# EAGLE design untitled (EAGLE 9.6.2)
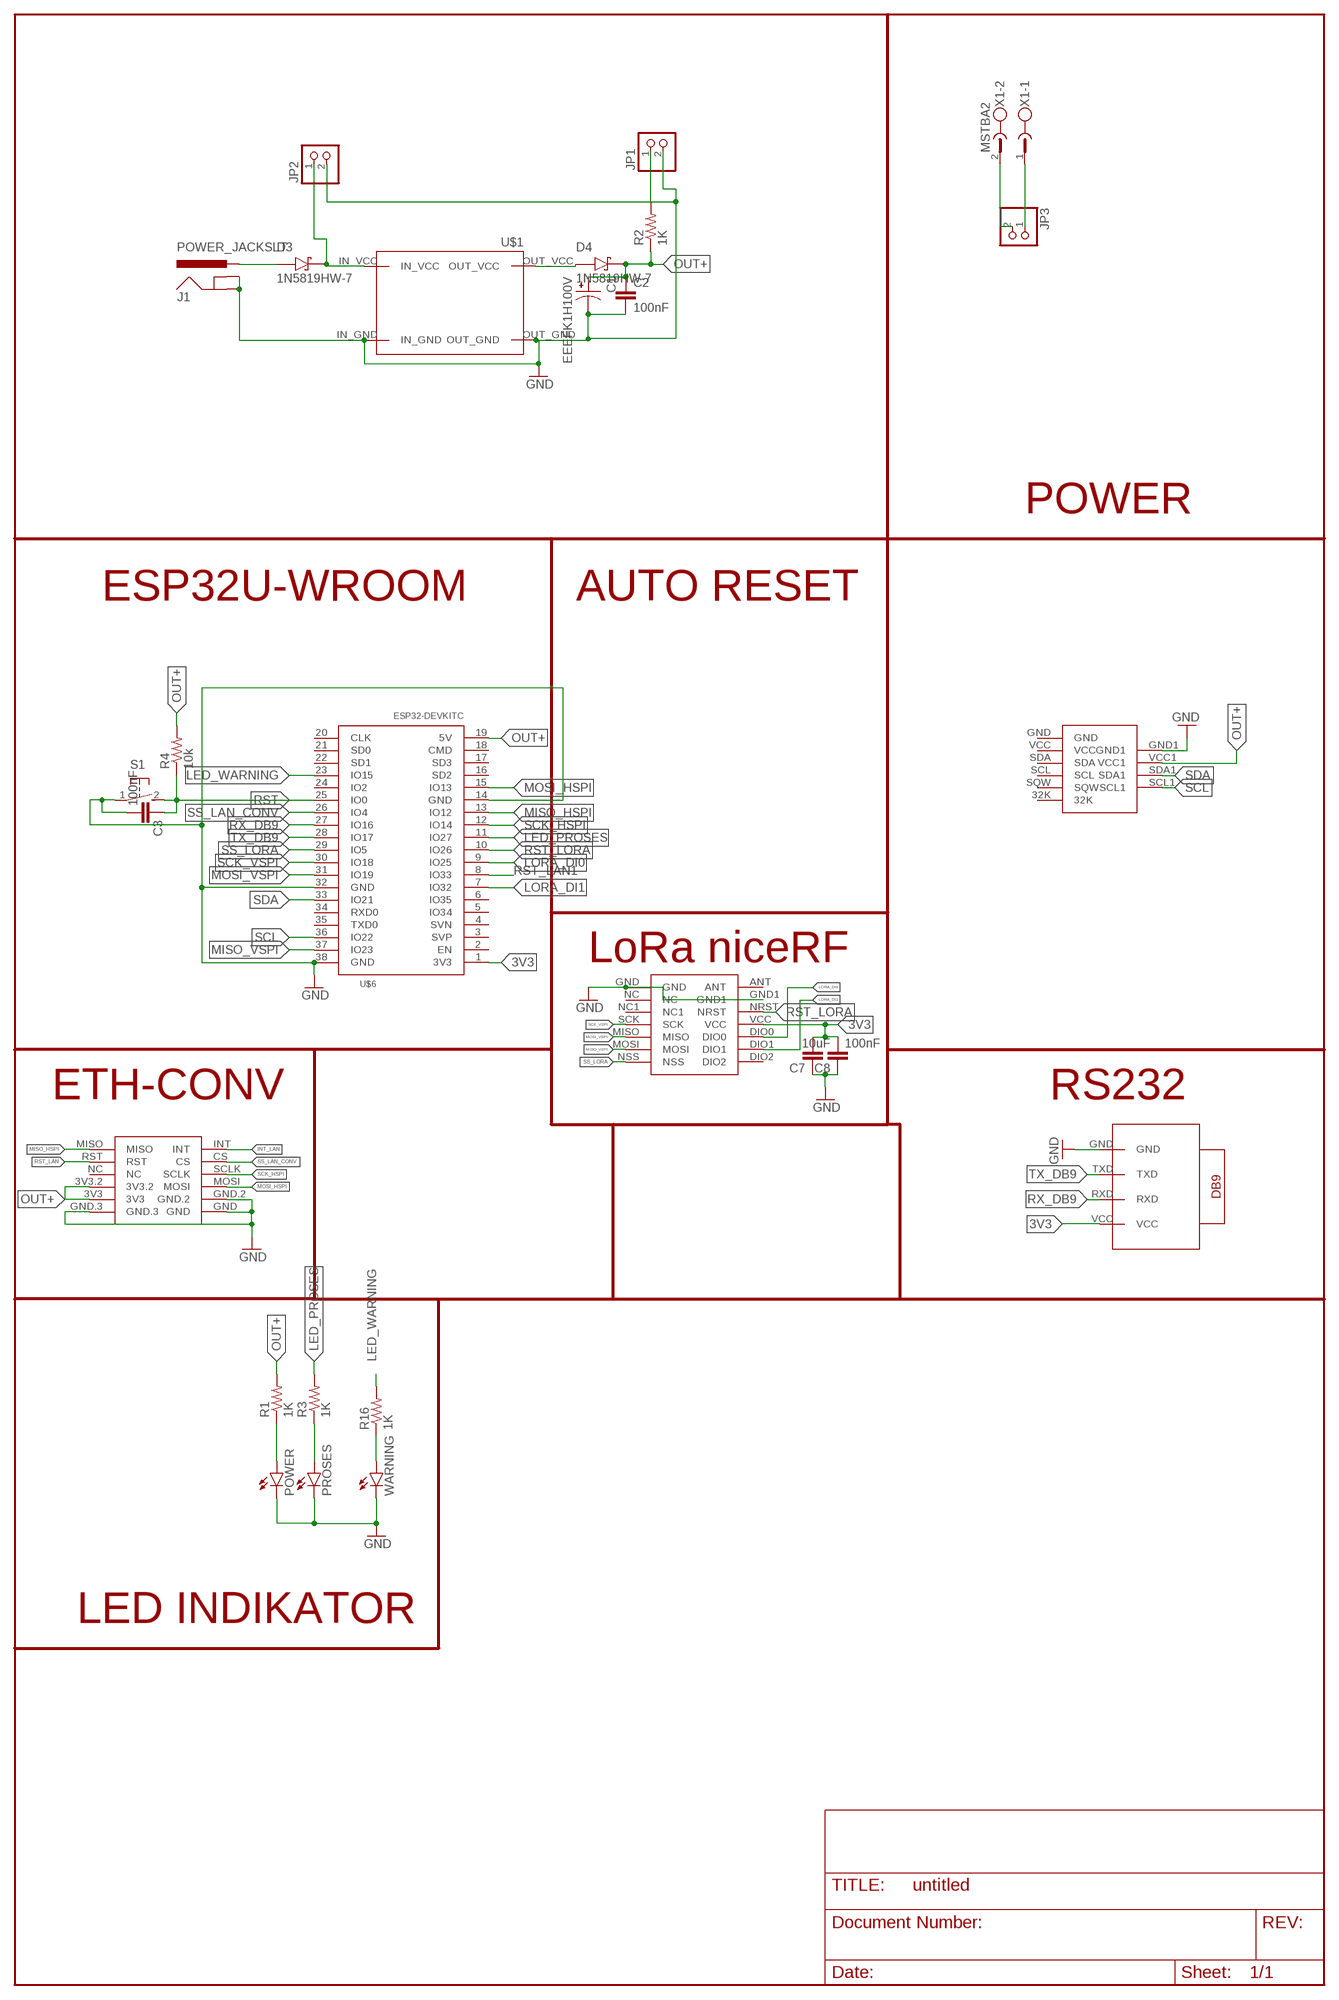
[diagram p0: schematic, sheet 1]

## Parts
C1  EEEFK1H100V  [CAP_EEEFK1H100V]
C2  100nF  C-EUC0805K  [C0805K]
C3  100nF  C-EUC0805K  [C0805K]
C7  10uF  C-EUC0805K  [C0805K]
C8  100nF  C-EUC0805K  [C0805K]
D3  1N5819HW-7  [SOD3715X145N]
D4  1N5819HW-7  [SOD3715X145N]
J1  POWER_JACKSLT  [POWER_JACK_SLOT]
JP1  PINHD-1X2  [1X02]
JP2  PINHD-1X2  [1X02]
JP3  PINHD-1X2  [1X02]
LORA-NICERF-V1  LORA-NICERF-V2  [LORA-NICERF-V2]
POWER  TLLR4400  [LED3MM]
PROSES  TLLR4400  [LED3MM]
R1  1K  R-US_M0805  [M0805]
R2  1K  R-US_M0805  [M0805]
R3  1K  R-US_M0805  [M0805]
R4  10k  R-US_M0805  [M0805]
R16  1K  R-US_M0805  [M0805]
RTC1  RTC3231  [RTC3231]
S1  31-XX  [B3F-31XX]
U$1  STEPDOWN_SY8205  [STEPDOWN_SY8205]
U$3  MINI_W5500  [MINI_W5500]
U$5  RS232-BREAKOUTBREAKOUT  [RS232-BREAKOUT]
U$6  ESP32DEVKITC  [ESP32-DEVKITC]
WARNING  TLLR4400  [LED3MM]
X1  MSTBA2  [MSTBA2]

## Nets
3V3: C7.2 C8.2 LORA-NICERF-V1.VCC U$5.VCC U$6.1(3V3)
GND: C1.2 C2.2 C3.2 C7.1 C8.1 J1.GND@1(GNDBREAK) J1.GND@2(GND) JP1.2 JP2.2 LORA-NICERF-V1.GND LORA-NICERF-V1.GND1 POWER.K(C) PROSES.K(C) RTC1.GND1 S1.1(P) U$1.IN_GND U$1.OUT_GND U$3.GND U$3.GND.2 U$3.GND.3 U$5.GND U$6.14(GND) U$6.32(GND) U$6.38(GND) WARNING.K(C)
INT_LAN: U$3.INT
LED_PROSES: R3.2 U$6.11(IO27)
LED_WARNING: R16.2 U$6.23(IO15)
LORA_DI0: LORA-NICERF-V1.DIO0 U$6.9(IO25)
LORA_DI1: LORA-NICERF-V1.DIO1 U$6.7(IO32)
MISO_HSPI: U$3.MISO U$6.13(IO12)
MISO_VSPI: LORA-NICERF-V1.MOSI U$6.37(IO23)
MOSI_HSPI: U$3.MOSI U$6.15(IO13)
MOSI_VSPI: LORA-NICERF-V1.MISO U$6.31(IO19)
N$1: POWER.A R1.1
N$2: D3.A J1.PWR
N$3: PROSES.A R3.1
N$4: D3.C(K) JP2.1 U$1.IN_VCC
N$5: JP3.2 X1.2
N$6: D4.A U$1.OUT_VCC
N$7: JP1.1 R2.2
N$8: JP3.1 X1.1
N$16: R16.1 WARNING.A
OUT+: C1.1 C2.1 D4.C(K) R1.2 R2.1 R4.2 RTC1.VCC1 U$3.3V3 U$3.3V3.2 U$6.19(5V)
RST: C3.1 R4.1 S1.2(S) U$6.25(IO0)
RST_LAN: U$3.RST
RST_LAN1: U$6.8(IO33)
RST_LORA: LORA-NICERF-V1.NRST U$6.10(IO26)
RX_DB9: U$5.RXD U$6.27(IO16)
SCK_HSPI: U$3.SCLK U$6.12(IO14)
SCK_VSPI: LORA-NICERF-V1.SCK U$6.30(IO18)
SCL: RTC1.SCL1 U$6.36(IO22)
SDA: RTC1.SDA1 U$6.33(IO21)
SS_LAN_CONV: U$3.CS U$6.26(IO4)
SS_LORA: LORA-NICERF-V1.NSS U$6.29(IO5)
TX_DB9: U$5.TXD U$6.28(IO17)
Unconnected: LORA-NICERF-V1.ANT LORA-NICERF-V1.DIO2 LORA-NICERF-V1.NC LORA-NICERF-V1.NC1 RTC1.32K RTC1.GND RTC1.SCL RTC1.SDA RTC1.SQW RTC1.VCC U$3.NC U$6.2(EN) U$6.3(SVP) U$6.4(SVN) U$6.5(IO34) U$6.6(IO35) U$6.16(SD2) U$6.17(SD3) U$6.18(CMD) U$6.20(CLK) U$6.21(SD0) U$6.22(SD1) U$6.24(IO2) U$6.34(RXD0) U$6.35(TXD0)

## Notes on the sheet
- POWER
- ESP32U-WROOM | AUTO RESET
- LoRa niceRF
- ETH-CONV | RS232
- LED INDIKATOR

## Library data of the parts
C1 = EEEFK1H100V:EEEFK1H100V: Check availability <https://pricing.snapeda.com/parts/EEEFK1H100V/Panasonic/view-part?ref=eda>; AVAILABILITY: In Stock; DESCRIPTION: CAP ALUM 10UF 20% 50V SMD; MF: Panasonic; MP: EEEFK1H100V; PACKAGE: RADIAL-2 Panasonic; PRICE: None; PURCHASE-URL: https://pricing.snapeda.com/search/part/EEEFK1H100V/?ref=eda
C2 C3 C7 C8 = rcl:C-EU: CAPACITOR, European symbol; SPICEPREFIX: C
D3 D4 = 1N5819HW-7:1N5819HW-7: 1N5819HW Series 40 V 1 A Surface Mount Schottky Barrier Rectifier - SOD-123 Check availability <https://pricing.snapeda.com/parts/1N5819HW-7/Diodes%20Inc./view-part?ref=eda>; AVAILABILITY: In Stock; DESCRIPTION: Diode Schottky 40 V 1A Surface Mount SOD-123; MF: Diodes Inc.; MP: 1N5819HW-7; PACKAGE: SOD-123 Fairchild Semiconductor; PRICE: None; PURCHASE-URL: https://pricing.snapeda.com/search/part/1N5819HW-7/?ref=eda
J1 = SparkFun-Connectors:POWER_JACK: Power Jack Connector This is the standard 5.5mm barrel jack for power. The PTH is the most common, proven, reliable, footprint. The Slot footprint only works if the mill layer is transmitted to the PCB fab house so be warned. Here are the connectors we sell at SparkFun: DC Barrel Power Jack/Connector <https://www.sparkfun.com/products/119> (PRT-00119) DC Barrel Power Jack/Connector (SMD) <https://www.sparkfun.com/products/12748> (PRT-12748) DC Barrel Jack Adapter - Breadboard Compatible <https://www.sparkfun.com/products/10811> (PRT-10811) It is used on this SparkFun product (and many, many others): SparkFun RedBoard - Programmed with Arduino <https://www.sparkfun.com/products/12757> (DEV-12757) Also, if you need a mating power supply or connector, please check these out: Wall Adapter Power Supply - 9VDC 650mA <https://www.sparkfun.com/products/298> (TOL-00298) DC Barrel Jack Adapter - Male <https://www.sparkfun.com/products/10287> (PRT-10287); PROD_ID: PRT-00119
JP1-JP3 = pinhead:PINHD-1X2: PIN HEADER
LORA-NICERF-V1 = LORA-NICERF-V2:LORA-NICERF-V2
POWER PROSES WARNING = led:TLLR4400: Low Current (2mA) LED 3 mm Tinted Diffused Package color RED Source: Data sheet <http://www.farnell.com/datasheets/391100.pdf>; MF: VISHAY SEMICONDUCTOR; OC_FARNELL: 1612437
R1-R4 R16 = adafruit:R-US_: RESISTOR, American symbol
RTC1 = rtc3231:RTC3231
S1 = switch-omron:31-XX: OMRON SWITCH; MPN: B3F-3100; OC_FARNELL: 959704; OC_NEWARK: 36M3582
U$1 = STEPDOWN_SY8205:STEPDOWN_SY8205
U$3 = ethernet-mikroavr:MINI_W5500: MINI ETHERNET W5500, CREATE BY MIKROAVR.COM
U$5 = RS232-BREAKOUT:RS232-BREAKOUT
U$6 = ESP32-DEVKITC:ESP32DEVKITC
X1 = con-phoenix-508:MSTBA2: PHOENIX; MF: FARNELL; MPN: 1757242; OC_FARNELL: 3705171; OC_NEWARK: 71C4161

## Net classes
0 default: clearance 0.1 mm

## Board
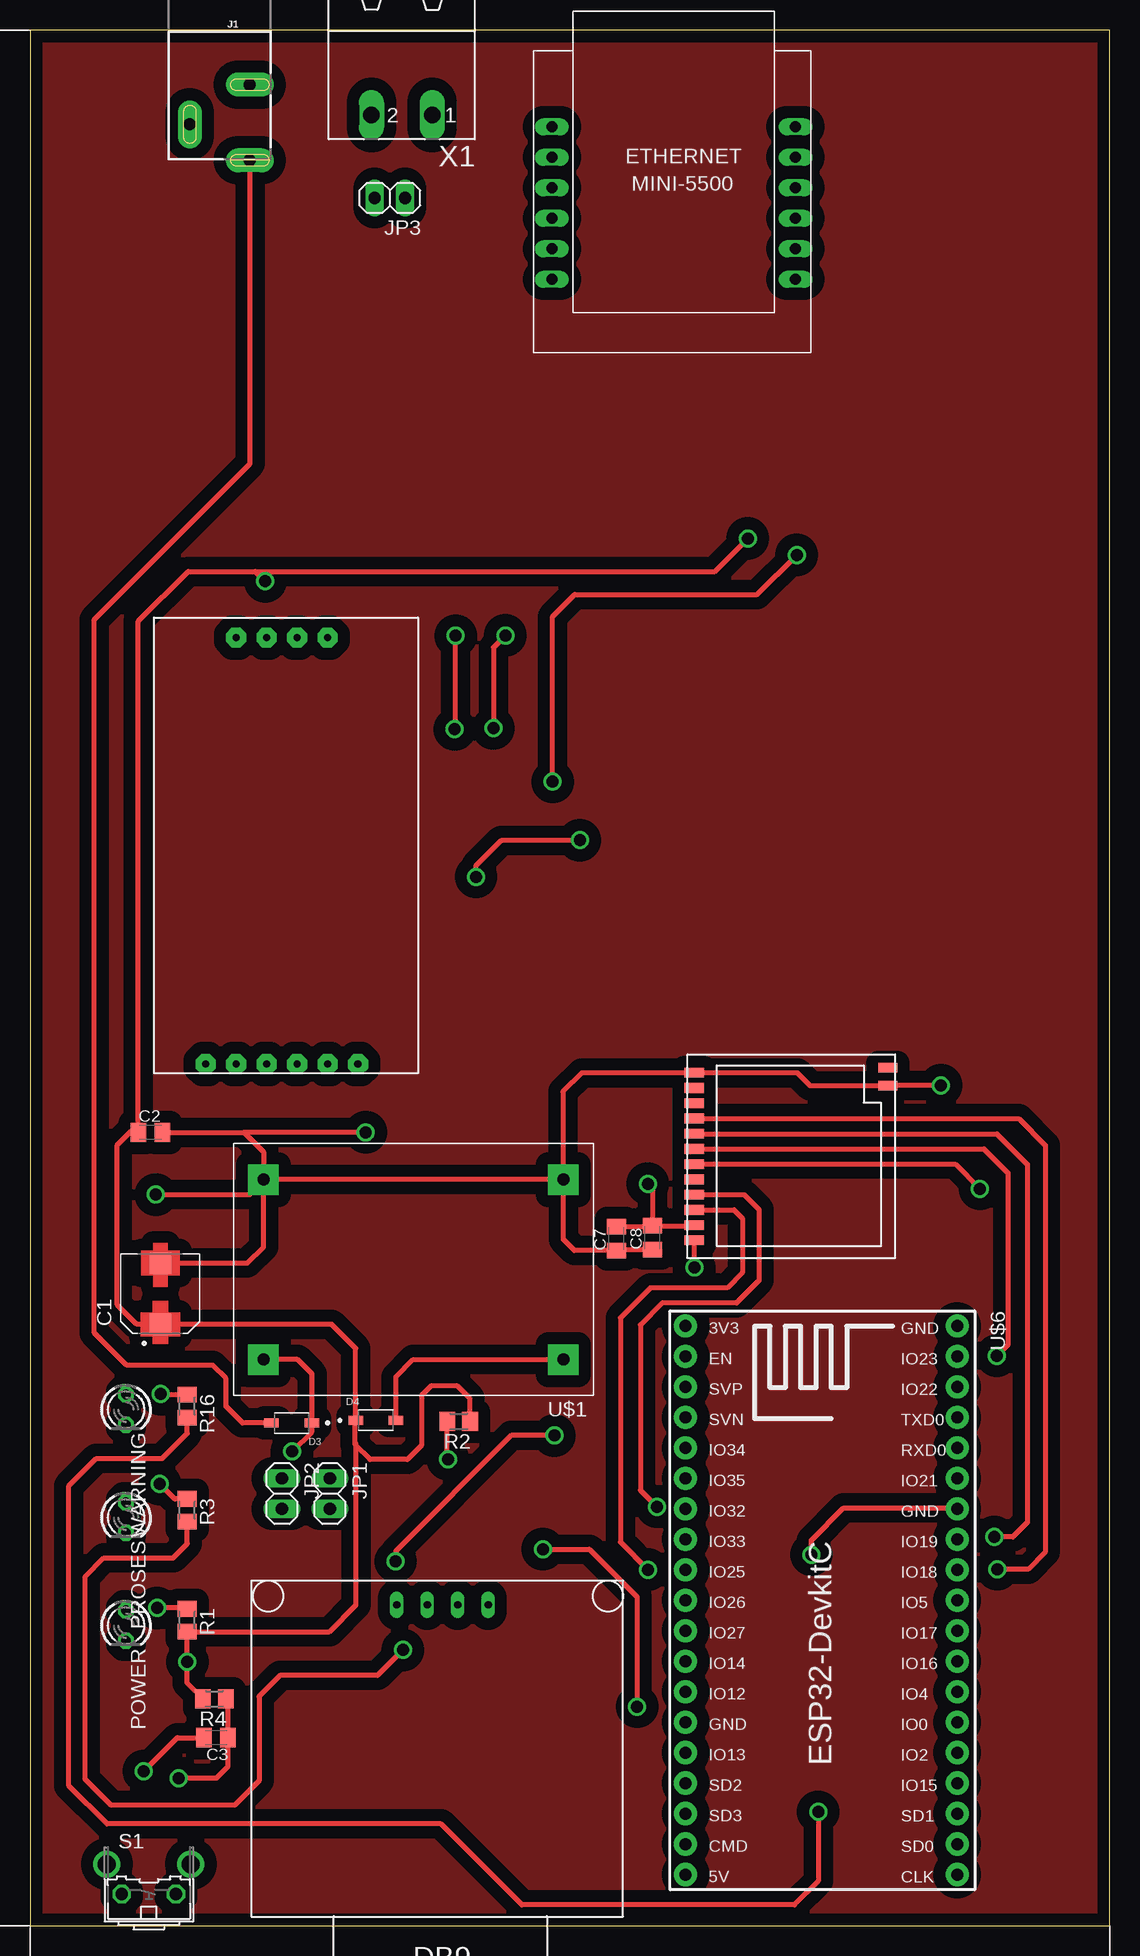
[diagram p1: board, top side]
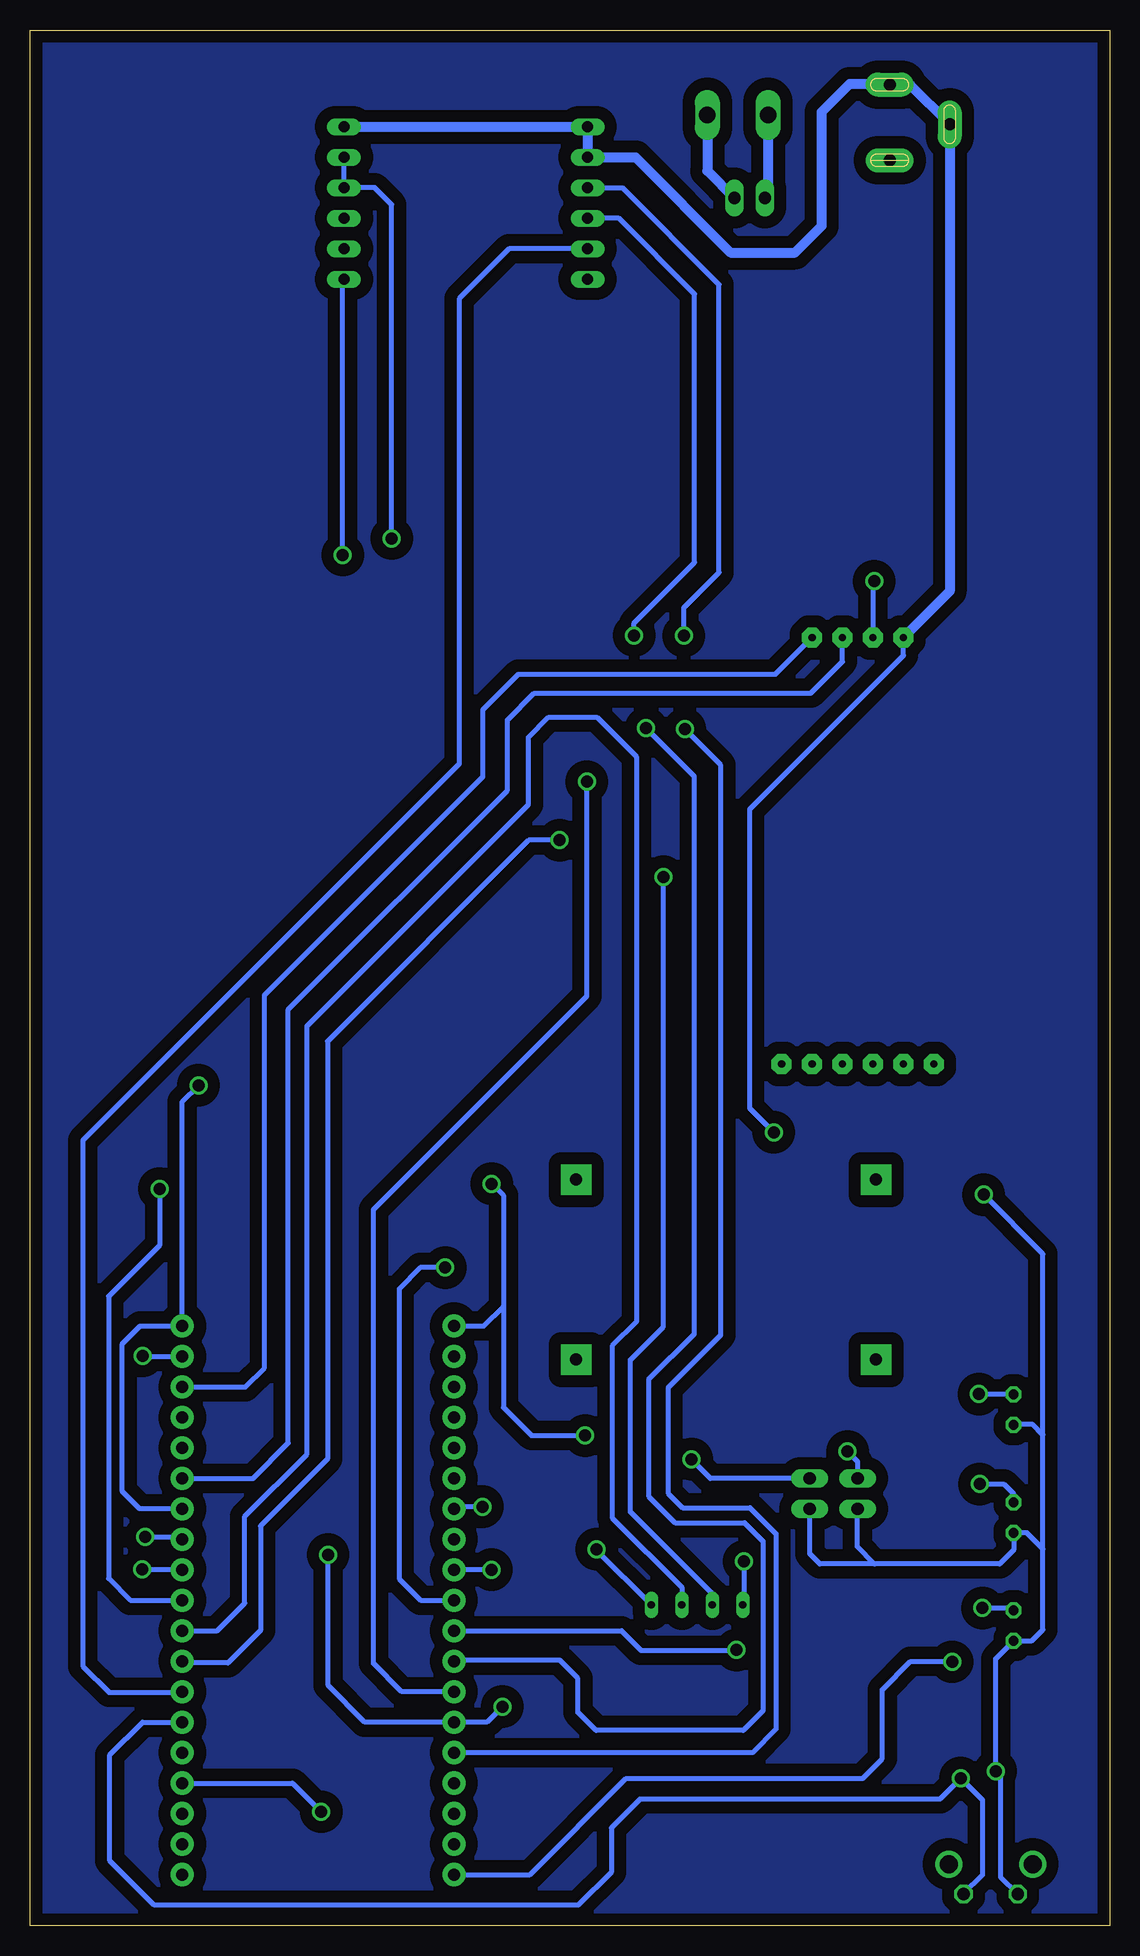
[diagram p2: board, bottom side, seen from below]

Size 90 x 158 mm. Coordinates in mm from the lower left corner, seen from the top.
Outline: 0,0 90,0 90,158 0,158 0,0
Copper layers (1*16): Top 0.035mm / dielectric 1.5mm / Bottom 0.035mm
Design rules "default": minimum track width 6mil, minimum drill 0.35mm, track to track 6mil, track to pad 6mil, pad to pad 6mil, via to via 6mil, smd to smd 6mil, copper to edge 40mil, drill to drill 6mil, minimum pad ring 10mil, minimum via ring 8mil, stop-mask expansion 4mil, vias tented up to drill 0mil, thermal gap 10mil

### Footprints (pad centres in the part's own frame; a part is rotated, then mirrored left to right if it is on the bottom)
CAP_EEEFK1H100V = smd 1.8 x 1.8: 1 -2.55,0; 2 2.55,0
C0805K = smd 1.3 x 1.6: 1 -1,0; 2 1,0
SOD3715X145N = smd 1.21 x 0.73: A 1.68,0; C -1.68,0
POWER_JACK_SLOT = drill 1 pad 2 long: GND@1 2.58,7.5; GND@2 7.58,10.8; PWR 2.58,13.8
1X02 = drill 1.016 long: 1 -1.27,0; 2 1.27,0
LORA-NICERF-V2 = smd 1.6 x 0.8: ANT 8.37,6.81; DIO0 -7.77,-5.03; DIO1 -7.77,-3.76; DIO2 -7.77,-2.49; GND -7.77,6.4; GND1 8.37,5.31; MISO -7.77,1.32; MOSI -7.77,0.05; NC -7.77,5.13; NC1 -7.77,3.86; NRST -7.77,-7.57; NSS -7.77,-1.22; SCK -7.77,2.59; VCC -7.77,-6.3
LED3MM = drill 0.813 octagon: A -1.27,0; K 1.27,0
M0805 = smd 1.3 x 1.6: 1 -0.95,0; 2 0.95,0
RTC3231 = drill 0.6 pad 1.676 octagon: 32K -15.24,0; GND -15.24,12.7; GND1 20.32,10.16; SCL -15.24,5.08; SCL1 20.32,2.54; SDA -15.24,7.62; SDA1 20.32,5.08; SQW -15.24,2.54; VCC -15.24,10.16; VCC1 20.32,7.62
B3F-31XX = drill 1.016 octagon: 1 -2.261,-1.245; 2 2.261,-1.245 | drill 1.499 pad 2.159: 3 -3.505,1.245; 4 3.505,1.245
STEPDOWN_SY8205 = drill 1 pad 2.54 square: IN_GND 18,-2.5; IN_VCC 3,-2.5; OUT_GND 18,-27.5; OUT_VCC 3,-27.5
MINI_W5500 = drill 0.914 long: 3V3 21.844,-8.89; 3V3.2 21.844,-11.43; CS 1.524,-16.51; GND 1.524,-6.35; GND.2 1.524,-8.89; GND.3 21.844,-6.35; INT 1.524,-19.05; MISO 21.844,-19.05; MOSI 1.524,-11.43; NC 21.844,-13.97; RST 21.844,-16.51; SCLK 1.524,-13.97
RS232-BREAKOUT = drill 0.6 long: GND 11.25,2; RXD 16.33,2; TXD 13.79,2; VCC 18.87,2
ESP32-DEVKITC = drill 1 pad 1.93: 1 -22.87,-11.42; 2 -20.33,-11.42; 3 -17.79,-11.42; 4 -15.25,-11.42; 5 -12.71,-11.42; 6 -10.17,-11.42; 7 -7.63,-11.42; 8 -5.09,-11.42; 9 -2.55,-11.42; 10 -0.01,-11.42; 11 2.53,-11.42; 12 5.07,-11.42; 13 7.61,-11.42; 14 10.15,-11.42; 15 12.69,-11.42; 16 15.23,-11.42; 17 17.77,-11.42; 18 20.31,-11.42; 19 22.85,-11.42; 20 22.85,11.23; 21 20.31,11.23; 22 17.77,11.23; 23 15.23,11.23; 24 12.69,11.23; 25 10.15,11.23; 26 7.61,11.23; 27 5.07,11.23; 28 2.53,11.23; 29 -0.01,11.23; 30 -2.55,11.23; 31 -5.09,11.23; 32 -7.63,11.23; 33 -10.17,11.23; 34 -12.71,11.23; 35 -15.25,11.23; 36 -17.79,11.23; 37 -20.33,11.23; 38 -22.87,11.23
MSTBA2 = drill 1.397 long: 1 -2.54,5.08; 2 2.54,5.08

### Placement (x,y rotation side)
C1  10.86,52.66 90 top
C2  10.04,66.11 0 top
C3  15.51,15.66 180 top
C7  48.89,57.26 90 top
C8  51.89,57.34 90 top
D3  21.82,41.89 180 top
D4  28.83,42.11 0 top
J1  20.91,160.94 180 top
JP1  25,36 270 top
JP2  21,36 270 top
JP3  30,144 180 top
LORA-NICERF-V1  63.14,64.68 0 top
POWER  8,25 270 top
PROSES  8,34 270 top
R1  13.11,25.45 270 top
R2  35.74,42.02 180 top
R3  13.11,34.61 270 top
R4  15.37,18.89 180 top
R16  13.11,43.29 270 top
RTC1  27.34,87.04 90 top
S1  9.91,3.87 0 top
U$1  16.96,44.18 90 top
U$3  41.98,156.27 0 top
U$5  49.45,28.73 180 top
U$6  66.07,27.1 270 top
WARNING  8,43 270 top
X1  31,156 180 top

### Tracks (layer width: path | path; a pad name or v marks a point on that pad's centre or on a via)
3V3  (via drill 1)
  Top 0.406: C7.2 51.81,58.26 | 51.81,58.26 C8.2 51.89,61.45 v51.51,61.83 | LORA-NICERF-V1.VCC 55.25,58.26 51.81,58.26 | v43.71,40.84 40.12,40.84 30.48,31.2 v30.48,30.36
  Bottom 0.406: U$6.1 52.18,49.97 50.53,51.61 | 50.53,51.61 50.53,60.86 v51.51,61.83 | 50.53,51.61 50.53,43.17 48.2,40.84 v43.71,40.84 | v30.48,30.36 30.48,26.83 U$5.VCC
GND  (via drill 1)
  Top 0.406: C8.1 48.97,56.34 C7.1 45.38,56.26 44.46,57.18 U$1.OUT_GND | U$1.OUT_GND 44.42,62.22 44.42,69.5 46,71.08 LORA-NICERF-V1.GND 63.96,71.08 65.05,69.99 LORA-NICERF-V1.GND1 71.56,70.04 v75.94,70.04 | v9.48,12.87 12.28,15.66 C3.2 | C2.2 17.84,66.11 | U$1.IN_GND 19.46,64.49 17.84,66.11 | C1.2 18.11,55.21 19.46,56.56 19.46,62.06 | 19.46,62.06 U$1.IN_GND | v10.5,60.92 18.32,60.92 19.46,62.06 | U$1.OUT_GND U$1.IN_GND | v65.14,30.91 65.14,32.12 67.82,34.79 77.24,34.79 U$6.32 | v42.76,31.37 46.63,31.37 50.62,27.39 v50.62,18.24 | v28,66.12 17.85,66.12 17.84,66.11
  Bottom 0.406: v75.94,70.04 77.3,68.68 U$6.38 80.81,49.97 82.3,48.48 82.3,36.17 80.86,34.73 U$6.32 | S1.1 9.09,4.06 9.09,12.47 v9.48,12.87 9.48,22.25 POWER.K 6.47,23.73 5.54,24.66 5.54,31.39 | 5.54,31.39 6.88,32.73 PROSES.K 8,31.31 9.17,30.14 19.59,30.14 | 19.59,30.14 21.04,31.59 21.04,34.69 JP2.2 | 19.59,30.14 24.15,30.14 25,31 JP1.2 | 5.54,31.39 5.54,40.9 | 5.54,40.9 6.39,41.75 7.98,41.75 WARNING.K | 5.54,40.9 5.54,55.97 v10.5,60.92 | RTC1.GND1 17.18,105.87 30.02,93.03 30.02,68.14 v28,66.12 | v65.14,30.91 65.14,20.01 62.09,16.95 U$6.14 51.91,16.95 v50.62,18.24 | U$5.GND 42.76,31.29 v42.76,31.37
  Bottom 0.813: U$3.GND.3 U$3.GND U$3.GND.2 39.52,147.38 31.59,139.45 26.22,139.45 24,141.67 24,151.17 21.66,153.5 18.39,153.5 J1.GND@1 16.63,153.44 J1.GND@2 13.33,111.21 RTC1.GND1
LED_PROSES  (via drill 1)
  Top 0.406: v31.09,22.96 28.97,20.84 20.84,20.84 19.1,19.09 19.1,12.05 17.08,10.03 6.76,10.03 4.59,12.21 4.59,29.05 6.17,30.62 11.92,30.62 13.12,31.83 13.12,33.65 R3.2
  Bottom 0.406: U$6.11 40.68,24.57 39.05,22.93 31.12,22.93 v31.09,22.96
LED_WARNING  (via drill 1)
  Top 0.406: v65.72,9.48 65.72,3.69 63.74,1.72 41.01,1.72 34.26,8.47 6.43,8.47 3.25,11.66 3.25,36.63 5.54,38.92 11.02,38.92 13.11,41.01 R16.2
  Bottom 0.406: U$6.23 68.11,11.87 v65.72,9.48
LORA_DI0  (via drill 1)
  Top 0.406: LORA-NICERF-V1.DIO0 58.7,59.65 59.41,58.94 59.41,54.44 58.13,53.16 51.72,53.16 49.21,50.65 49.21,31.96 v51.52,29.66
  Bottom 0.406: v51.52,29.66 U$6.9
LORA_DI1  (via drill 1)
  Top 0.406: LORA-NICERF-V1.DIO1 59.53,60.92 60.78,59.67 60.78,53.76 58.91,51.88 52.69,51.88 50.89,50.08 50.89,36.29 v52.27,34.9
  Bottom 0.406: v52.27,34.9 54.48,34.9 U$6.7
MISO_HSPI  (via drill 1)
  Top 0.406: v43.58,95.34 43.58,109.12 45.4,110.94 60.62,110.94 v63.93,114.25
  Bottom 0.406: U$6.13 59.01,19.49 61.37,21.85 61.37,59.68 43.58,77.46 v43.58,95.34 | v63.93,114.25 63.93,137.12 U$3.MISO
MISO_VSPI  (via drill 1)
  Top 0.406: LORA-NICERF-V1.MOSI 79.53,64.73 81.53,62.73 81.53,48.41 v80.6,47.48
  Bottom 0.406: v80.6,47.48 80.55,47.43 U$6.37
MOSI_HSPI  (via drill 1)
  Top 0.406: v35.41,99.71 35.49,99.8 v35.49,107.51
  Bottom 0.406: U$3.MOSI 40.61,144.84 32.56,136.79 32.56,112.78 35.49,109.84 v35.49,107.51 | U$6.15 29.77,14.41 27.8,16.38 27.8,32.66 29.96,34.83 35.6,34.83 36.8,36.03 36.8,44.81 32.4,49.21 32.4,96.71 v35.41,99.71
MOSI_VSPI  (via drill 1)
  Top 0.406: LORA-NICERF-V1.MISO 80.61,66 83.15,63.46 83.15,33.59 81.94,32.38 v80.39,32.38
  Bottom 0.406: v80.39,32.38 77.49,32.38 U$6.31
N$1  (via drill 1)
  Top 0.406: R1.1 13.04,26.47 v10.59,26.47
  Bottom 0.406: v10.59,26.47 8.2,26.47 POWER.A
N$2
  Top 0.406: D3.A 17.72,41.89 16.35,43.26 16.35,45.59 15.25,46.69 8.07,46.69 5.36,49.41 5.36,108.87 18.34,121.85 18.34,147.13 J1.PWR
N$3  (via drill 1)
  Top 0.406: R3.1 12.06,35.56 v10.83,36.8
  Bottom 0.406: v10.83,36.8 8.82,36.8 8,35.97 PROSES.A
N$4  (via drill 1)
  Top 0.406: v21.85,39.5 23.5,41.16 D3.C 23.5,45.98 22.3,47.18 U$1.IN_VCC
  Bottom 0.406: JP2.1 21,38.66 v21.85,39.5
N$5
  Bottom 0.813: X1.2 28.46,144.27 JP3.2
N$6
  Top 0.406: D4.A 30.51,45.75 31.94,47.18 U$1.OUT_VCC
N$7  (via drill 1)
  Top 0.406: v34.84,38.86 34.79,38.92 R2.2
  Bottom 0.406: JP1.1 33.27,37.27 34.84,38.84 v34.84,38.86
N$8
  Bottom 0.813: X1.1 33.54,146.27 JP3.1
N$9
  pour Top (isolate 1.016): 0,158 90,158 90,0 0,0
N$10
  pour Bottom (isolate 1.016): 0,158 90,158 90,0 0,0
N$16  (via drill 1)
  Top 0.406: R16.1 10.95,44.24 v10.89,44.3
  Bottom 0.406: v10.89,44.3 8.03,44.3 WARNING.A
OUT+  (via drill 1)
  Top 0.406: R4.2 13.11,20.2 v13.11,21.98 R1.2 24.97,24.5 27.19,26.72 27.19,40.17 27.11,40.25 | R2.1 36.69,43.92 35.63,44.98 33.43,44.98 32.64,44.19 32.64,40.01 31.46,38.84 28.34,38.84 27.11,40.07 27.11,40.25 | 27.11,40.25 27.11,42.08 D4.C 27.15,48.12 25.16,50.11 C1.1 8.9,50.11 7.28,51.74 7.28,65.06 8.44,66.23 8.92,66.23 C2.1 9.04,108.71 13.2,112.87 18.79,112.87 | 18.79,112.87 v19.62,112.04 | 18.79,112.87 57.1,112.87 v59.84,115.61
  Bottom 0.406: v19.62,112.04 19.72,111.94 RTC1.VCC1 | U$3.3V3 U$3.3V3.2 63.8,144.87 61.26,144.87 59.84,143.45 v59.84,115.61 | U$6.19 48.32,4.25 40.3,12.27 20.58,12.27 18.94,13.91 18.94,19.65 16.58,22 13.02,22 13,21.98 v13.11,21.98
RST  (via drill 1)
  Top 0.406: v12.4,12.28 15.53,12.28 16.51,13.26 C3.1 16.51,18.7 R4.1
  Bottom 0.406: S1.2 10.59,4.21 10.59,10.47 v12.4,12.28 14.12,10.56 39.12,10.56 41.54,8.14 41.54,4.46 44.3,1.7 79.63,1.7 83.34,5.41 83.34,14.23 80.62,16.95 U$6.25
RST_LORA  (via drill 1)
  Top 0.406: LORA-NICERF-V1.NRST 55.37,55.02 55.35,54.99 55.35,54.87 v55.38,54.84
  Bottom 0.406: v55.38,54.84 57.47,54.84 59.23,53.08 59.23,28.91 57.43,27.11 U$6.10
RX_DB9  (via drill 1)
  Top 0.406: v37.19,87.42 37.19,88.37 39.25,90.43 45.8,90.43 v45.85,90.47
  Bottom 0.406: U$5.RXD 33.12,27.65 39.95,34.48 39.95,47.16 37.19,49.92 v37.19,87.42 | v45.85,90.47 48.43,90.47 65.21,73.69 65.21,38.88 70.78,33.3 70.78,24.59 73.48,21.89 77.16,21.89 U$6.27
SCK_HSPI  (via drill 1)
  Top 0.406: v39.63,107.53 38.64,106.54 v38.64,99.81
  Bottom 0.406: U$3.SCLK 40.9,142.3 34.6,135.99 34.6,113.61 39.63,108.58 v39.63,107.53 | U$6.12 54.57,22.11 45.83,22.11 44.32,20.6 44.32,17.76 42.8,16.25 30.54,16.25 28.88,17.91 28.88,32.03 30.43,33.58 36.21,33.58 38.42,35.78 38.42,45.51 34.62,49.31 34.62,95.79 v38.64,99.81
SCK_VSPI  (via drill 1)
  Top 0.406: LORA-NICERF-V1.SCK 82.42,67.27 84.66,65.03 84.66,31.15 83.21,29.7 v80.64,29.7
  Bottom 0.406: v80.64,29.7 77.35,29.7 U$6.30
SCL
  Bottom 0.406: U$6.36 72.05,44.89 70.44,46.5 70.44,77.56 52.25,95.76 52.25,101.33 49.27,104.31 27.85,104.31 RTC1.SCL1
SDA
  Bottom 0.406: U$6.33 71.41,37.27 68.46,40.22 68.46,76.37 50.2,94.62 50.2,100.48 47.97,102.71 24.9,102.71 22.26,105.35 RTC1.SDA1
SS_LAN_CONV
  Bottom 0.406: U$3.CS 50.05,139.76 54.22,135.59 54.22,96.82 85.59,65.45 85.59,21.61 83.4,19.42 77.37,19.42 U$6.26
SS_LORA  (via drill 1)
  Top 0.406: LORA-NICERF-V1.NSS 77.14,63.46 v79.2,61.4
  Bottom 0.406: v79.2,61.4 79.2,56.7 83.45,52.45 83.45,28.93 81.63,27.11 U$6.29
TX_DB9
  Bottom 0.406: U$6.28 74.39,24.57 72.1,26.86 72.1,34.09 66.9,39.28 66.9,74.98 48.46,93.42 48.46,99.03 46.76,100.73 42.74,100.73 39.45,97.43 39.45,50.31 41.46,48.3 41.46,34 35.66,28.2 U$5.TXD